# Altium schematic sheet Sheet1.SchDoc
size B; SheetNumber: 1; SheetTotal: 1
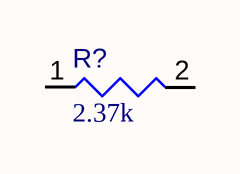
[diagram p0: Sheet1.SchDoc]

## Parts
R?  value 2.37k  [RESC0402(1005)_L]  (hidden comment: Resistor 2K37 +/-1 % 0402 63 mW)

## Nets

Not connected (* = marked no-connect by the designer): R? 1 2

## Library data of the parts
R? = CMP-009-00162-3: Chip Resistor, 2,37 kOhms, +/-1 %, 63 mW, -55 to 155 degC, 0402; Power: 63mW; Tolerance: 1%; Pins: 2; Max Operating Temperature: 155°C; Min Operating Temperature: -55°C; Case/Package: 0402